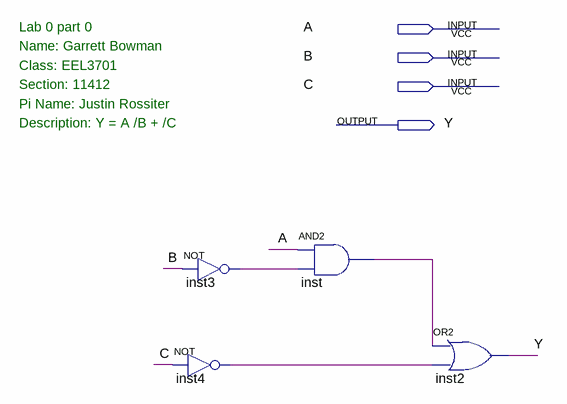
[diagram p0: schematic sheet]
// Quartus schematic lab1_ex.bdf as structural Verilog: 4 symbols, 4 pins
module lab1_ex (
  input  A,
  input  B,
  input  C,
  output Y
);

  wire inst3_out, inst4_out, inst_out;

  not inst3 (inst3_out, B);
  not inst4 (inst4_out, C);
  and inst (inst_out, A, inst3_out);
  or inst2 (Y, inst_out, inst4_out);

  // Notes on the sheet:
  //   Lab 0 part 0
  //   Name: Garrett Bowman
  //   Class: EEL3701 
  //   Section: 11412
  //   Pi Name: Justin Rossiter
  //   Description: Y = A /B + /C
endmodule
